# EAGLE design Main (EAGLE 8.2.2)
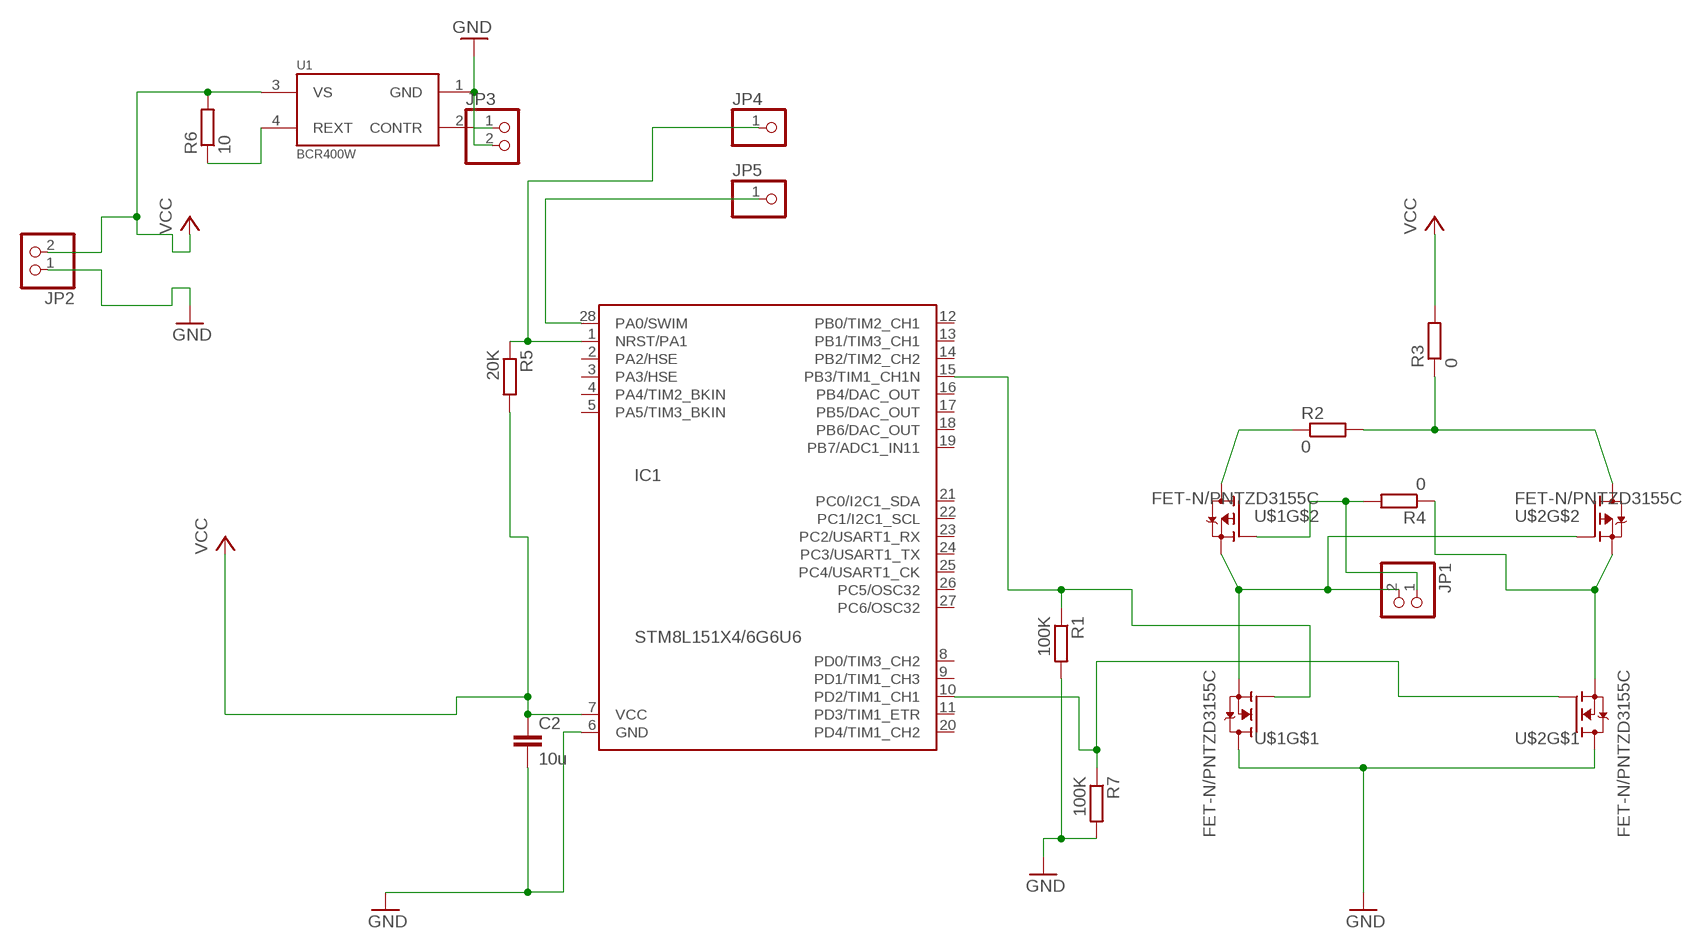
[diagram p0: schematic, sheet 1]

## Parts
C2  10u  C-EUC0805  [C0805]
IC1  STM8L151X4/6G6U6  [QFN28]
JP1  PINHD-1X2  [1X02]
JP2  PINHD-1X2  [1X02]
JP3  PINHD-1X2  [1X02]
JP4  PINHD-1X1  [1X01]
JP5  PINHD-1X1  [1X01]
R1  100K  R_0805  [R0805]
R2  0  R_0805  [R0805]
R3  0  R_0805  [R0805]
R4  0  R_0805  [R0805]
R5  20K  R_0805  [R0805]
R6  10  R_0805  [R0805]
R7  100K  R_0805  [R0805]
U1  BCR400W  [SOT130P210X100-4N]
U$1  FET-N/PNTZD3155C  [SOT-563]
U$2  FET-N/PNTZD3155C  [SOT-563]

## Nets
GND: C2.2 IC1.6(GND) JP2.1 JP3.2 R1.2 R7.2 U1.1(GND) U$1.6(D) U$2.6(D)
N$1: R6.1 U1.4(REXT)
N$2: IC1.28(PA0/SWIM) JP5.1
N$3: IC1.1(NRST/PA1) JP4.1 R5.1
N$4: JP3.1 U1.2(CONTR)
N$5: R4.1 U$2.1(S) U$2.4(S)
N$7: JP1.2 U$1.1(S) U$1.4(S) U$2.5(G)
N$8: IC1.10(PD2/TIM1_CH1) R7.1 U$2.2(G)
N$9: R2.1 U$1.3(D)
N$10: R2.2 R3.1 U$2.3(D)
N$11: JP1.1 R4.2 U$1.5(G)
N$12: IC1.15(PB3/TIM1_CH1N) R1.1 U$1.2(G)
VCC: C2.1 IC1.7(VCC) JP2.2 R3.2 R5.2 R6.2 U1.3(VS)
Unconnected: IC1.2(PA2/HSE) IC1.3(PA3/HSE) IC1.4(PA4/TIM2_BKIN) IC1.5(PA5/TIM3_BKIN) IC1.8(PD0/TIM3_CH2) IC1.9(PD1/TIM1_CH3) IC1.11(PD3/TIM1_ETR) IC1.12(PB0/TIM2_CH1) IC1.13(PB1/TIM3_CH1) IC1.14(PB2/TIM2_CH2) IC1.16(PB4/DAC_OUT) IC1.17(PB5/DAC_OUT) IC1.18(PB6/DAC_OUT) IC1.19(PB7/ADC1_IN11) IC1.20(PD4/TIM1_CH2) IC1.21(PC0/I2C1_SDA) IC1.22(PC1/I2C1_SCL) IC1.23(PC2/USART1_RX) IC1.24(PC3/USART1_TX) IC1.25(PC4/USART1_CK) IC1.26(PC5/OSC32) IC1.27(PC6/OSC32)

## Library data of the parts
C2 = rcl:C-EU: CAPACITOR, European symbol
IC1 = Namenlos:STM8L151X4/6
JP1-JP3 = pinhead:PINHD-1X2: PIN HEADER
JP4 JP5 = pinhead:PINHD-1X1: PIN HEADER
R1-R7 = Namenlos:R_
U1 = Namenlos:BCR400W: BCR400W Active Bias Controller SOT130P210X100-4N
U$1 U$2 = Namenlos:FET-N/P

## Board
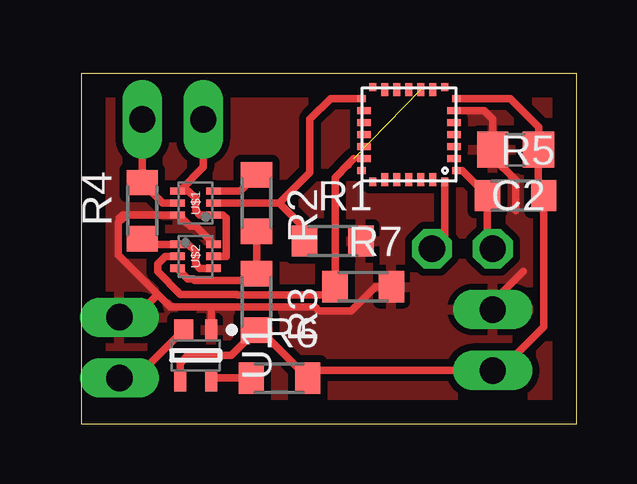
[diagram p1: board, top side]
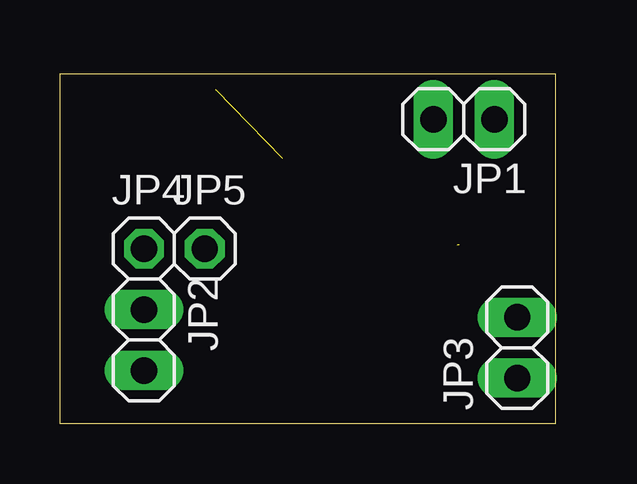
[diagram p2: board, bottom side, seen from below]

Size 20.64 x 14.61 mm. Coordinates in mm from the lower left corner, seen from the top.
Outline: 20.64,0 20.64,14.61 0,14.61 0,0 20.64,0
Copper layers (1*16): Top 0.035mm / dielectric 1.5mm / Bottom 0.035mm
Design rules "EagleDesignRules": minimum track width 0.2mm, minimum drill 0.3mm, track to track 0.2mm, track to pad 0.2mm, pad to pad 0.2mm, via to via 0.2mm, smd to smd 0.2mm, copper to edge 1mm, drill to drill 0.2mm, minimum pad ring 10mil, minimum via ring 8mil, stop-mask expansion 4mil, vias tented up to drill 0mil, thermal gap 0.25mm

### Footprints (pad centres in the part's own frame; a part is rotated, then mirrored left to right if it is on the bottom)
C0805 = smd 1.3 x 1.5: 1 -0.95,0; 2 0.95,0
QFN28 = smd 0.35 x 0.29: 1 -1.975,1.5; 7 -1.975,-1.5; 15 1.975,-1.5; 21 1.975,1.5 | smd 0.55 x 0.29: 2 -1.875,1; 3 -1.875,0.5; 4 -1.875,0; 5 -1.875,-0.5; 6 -1.875,-1; 16 1.875,-1; 17 1.875,-0.5; 18 1.875,0; 19 1.875,0.5; 20 1.875,1 | smd 0.29 x 0.35: 8 -1.5,-1.975; 14 1.5,-1.975; 22 1.5,1.975; 28 -1.5,1.975 | smd 0.29 x 0.55: 9 -1,-1.875; 10 -0.5,-1.875; 11 0,-1.875; 12 0.5,-1.875; 13 1,-1.875; 23 1,1.875; 24 0.5,1.875; 25 0,1.875; 26 -0.5,1.875; 27 -1,1.875
1X02 = drill 1.1 long: 1 -1.27,0; 2 1.27,0
1X01 = drill 1.1 octagon: 1 0,0
R0805 = smd 1.05 x 1.3: 1 -1.175,0; 2 1.175,0
SOT130P210X100-4N = smd 0.9 x 0.5: 1 -1.05,0.65; 3 1.05,-0.65; 4 1.05,0.65 | smd 0.9 x 0.8: 2 -1.05,-0.5
SOT-563 = smd 0.3 x 0.6: 1 -0.5,-0.75; 2 0,-0.75; 3 0.5,-0.75; 4 0.5,0.75; 5 0,0.75; 6 -0.5,0.75

### Placement (x,y rotation side)
C2  18.1,11.43 180 top
IC1  13.65,12.06 180 top
JP1  3.81,12.7 180 bottom
JP2  17.14,3.49 270 bottom
JP3  1.59,3.17 90 bottom
JP4  17.14,7.3 0 bottom
JP5  14.61,7.3 0 bottom
R1  10.48,7.62 0 top
R2  7.3,9.21 270 top
R3  7.3,5.08 270 top
R4  2.54,8.89 90 top
R5  18.1,9.53 0 top
R6  8.25,1.91 0 top
R7  11.75,5.71 0 top
U1  4.76,2.86 270 top
U$1  4.76,9.21 90 top
U$2  4.76,6.99 270 top

### Tracks (layer width: path | path; a pad name or v marks a point on that pad's centre or on a via)
GND
  Top 0.305: 16.83,11.75 C2.2 | IC1.6 16.78,13.06 17.14,12.7 C2.2 | C2.2 17.15,11.11 18.1,10.16 18.1,8.89 | U$2.6 5.44,7.58 4.76,8.26 4.54,8.26 U$1.6 1.72,8.71 | 1.72,8.71 1.59,8.57 | R7.2 12.25,5.71 11.24,4.71 9.9,4.71 9.74,4.87 4.76,4.87 | 3.18,5.4 1.54,7.04 1.54,8.39 1.72,8.57 1.72,8.71 | 3.18,5.4 3.71,4.87 4.76,4.87 | U1.1 5.41,4.86 4.76,4.87 | JP3.2 2.22,4.45 3.18,5.4 | JP2.1 17.14,5.08 18.41,6.35
  pour Top (isolate 0.305): 20.32,0 20.32,14.61 0,14.61 0,0
N$1
  Top 0.305: R6.1 5.51,1.91 U1.4
N$2
  Top 0.305: IC1.28 15.15,7.85 JP5.1
N$3
  Top 0.305: IC1.1 15.88,10.56 R5.1 16.92,7.53 JP4.1
N$4
  Top 0.305: JP3.1 2.26,1.91 U1.2
N$5  (1 unrouted)
  Top 0.305: U$2.1 2.77,7.48 R4.1 | U$2.4 4.95,6.49 4.76,6.67 4.76,7.18 4.46,7.49 4.09,7.49
N$6
  cutout Top (isolate 0.61, rank 2): 15.56,10.16 15.56,13.97 11.75,13.97 11.75,10.16
N$7  (2 unrouted)
  Top 0.305: 4.09,9.71 4.46,9.71 4.76,9.41 4.76,8.89 4.95,8.71 U$1.1 5.9,8.71 6.03,8.57 6.03,6.99 U$2.5 | JP1.2 5.08,10.7 4.09,9.71
N$8  (1 unrouted)
  Top 0.305: U$2.2 3.49,6.99 3.18,6.67 3.18,6.35 4.13,5.4 6.49,5.4 6.51,5.38 10.24,5.38 R7.1 10.57,10.28 11.15,10.86 | 11.15,10.86 11.15,10.83 11.11,10.79 | 11.36,11.06 11.15,10.86
N$9
  Top 0.305: U$1.3 6.63,9.71 R2.1
N$10
  Top 0.305: R2.2 R3.1 7.03,5.98 4.74,5.98 4.68,6.03 4.44,6.03 4.09,6.39 U$2.3
N$11
  Top 0.305: U$1.5 3.4,9.21 R4.2 JP1.1
N$12
  Top 0.305: 8.25,9.21 U$1.2 | 8.25,9.21 9.21,8.26 9.21,7.71 R1.1 | IC1.15 10.39,13.56 9.53,12.7 9.53,10.48 8.25,9.21
VCC
  Top 0.305: IC1.7 17.87,13.56 19.05,12.38 C2.1 19.05,9.75 R5.2 19.27,4.03 17.46,2.22 JP2.2 9.75,2.22 R6.2 7.43,3.91 R3.2 6.25,2.86 4.44,2.86 4.11,2.53 U1.3